# EasyEDA Pro project Dual_ESC_6-24V_3.6A_V4_Easy_EDA.epro

# Schematic Schematic1_3
Board Name: Dual ESC 6-24V 3.6A V4; Create Date: 2026-04-15; Page Name: P1; Project Name: Robin Dual ESC 6-24V 3.7A; Schematic Name: Schematic1_3; Update Date: 2026-05-05; Company: EasyEDA.com; Page Size: A4; Version: V1.0
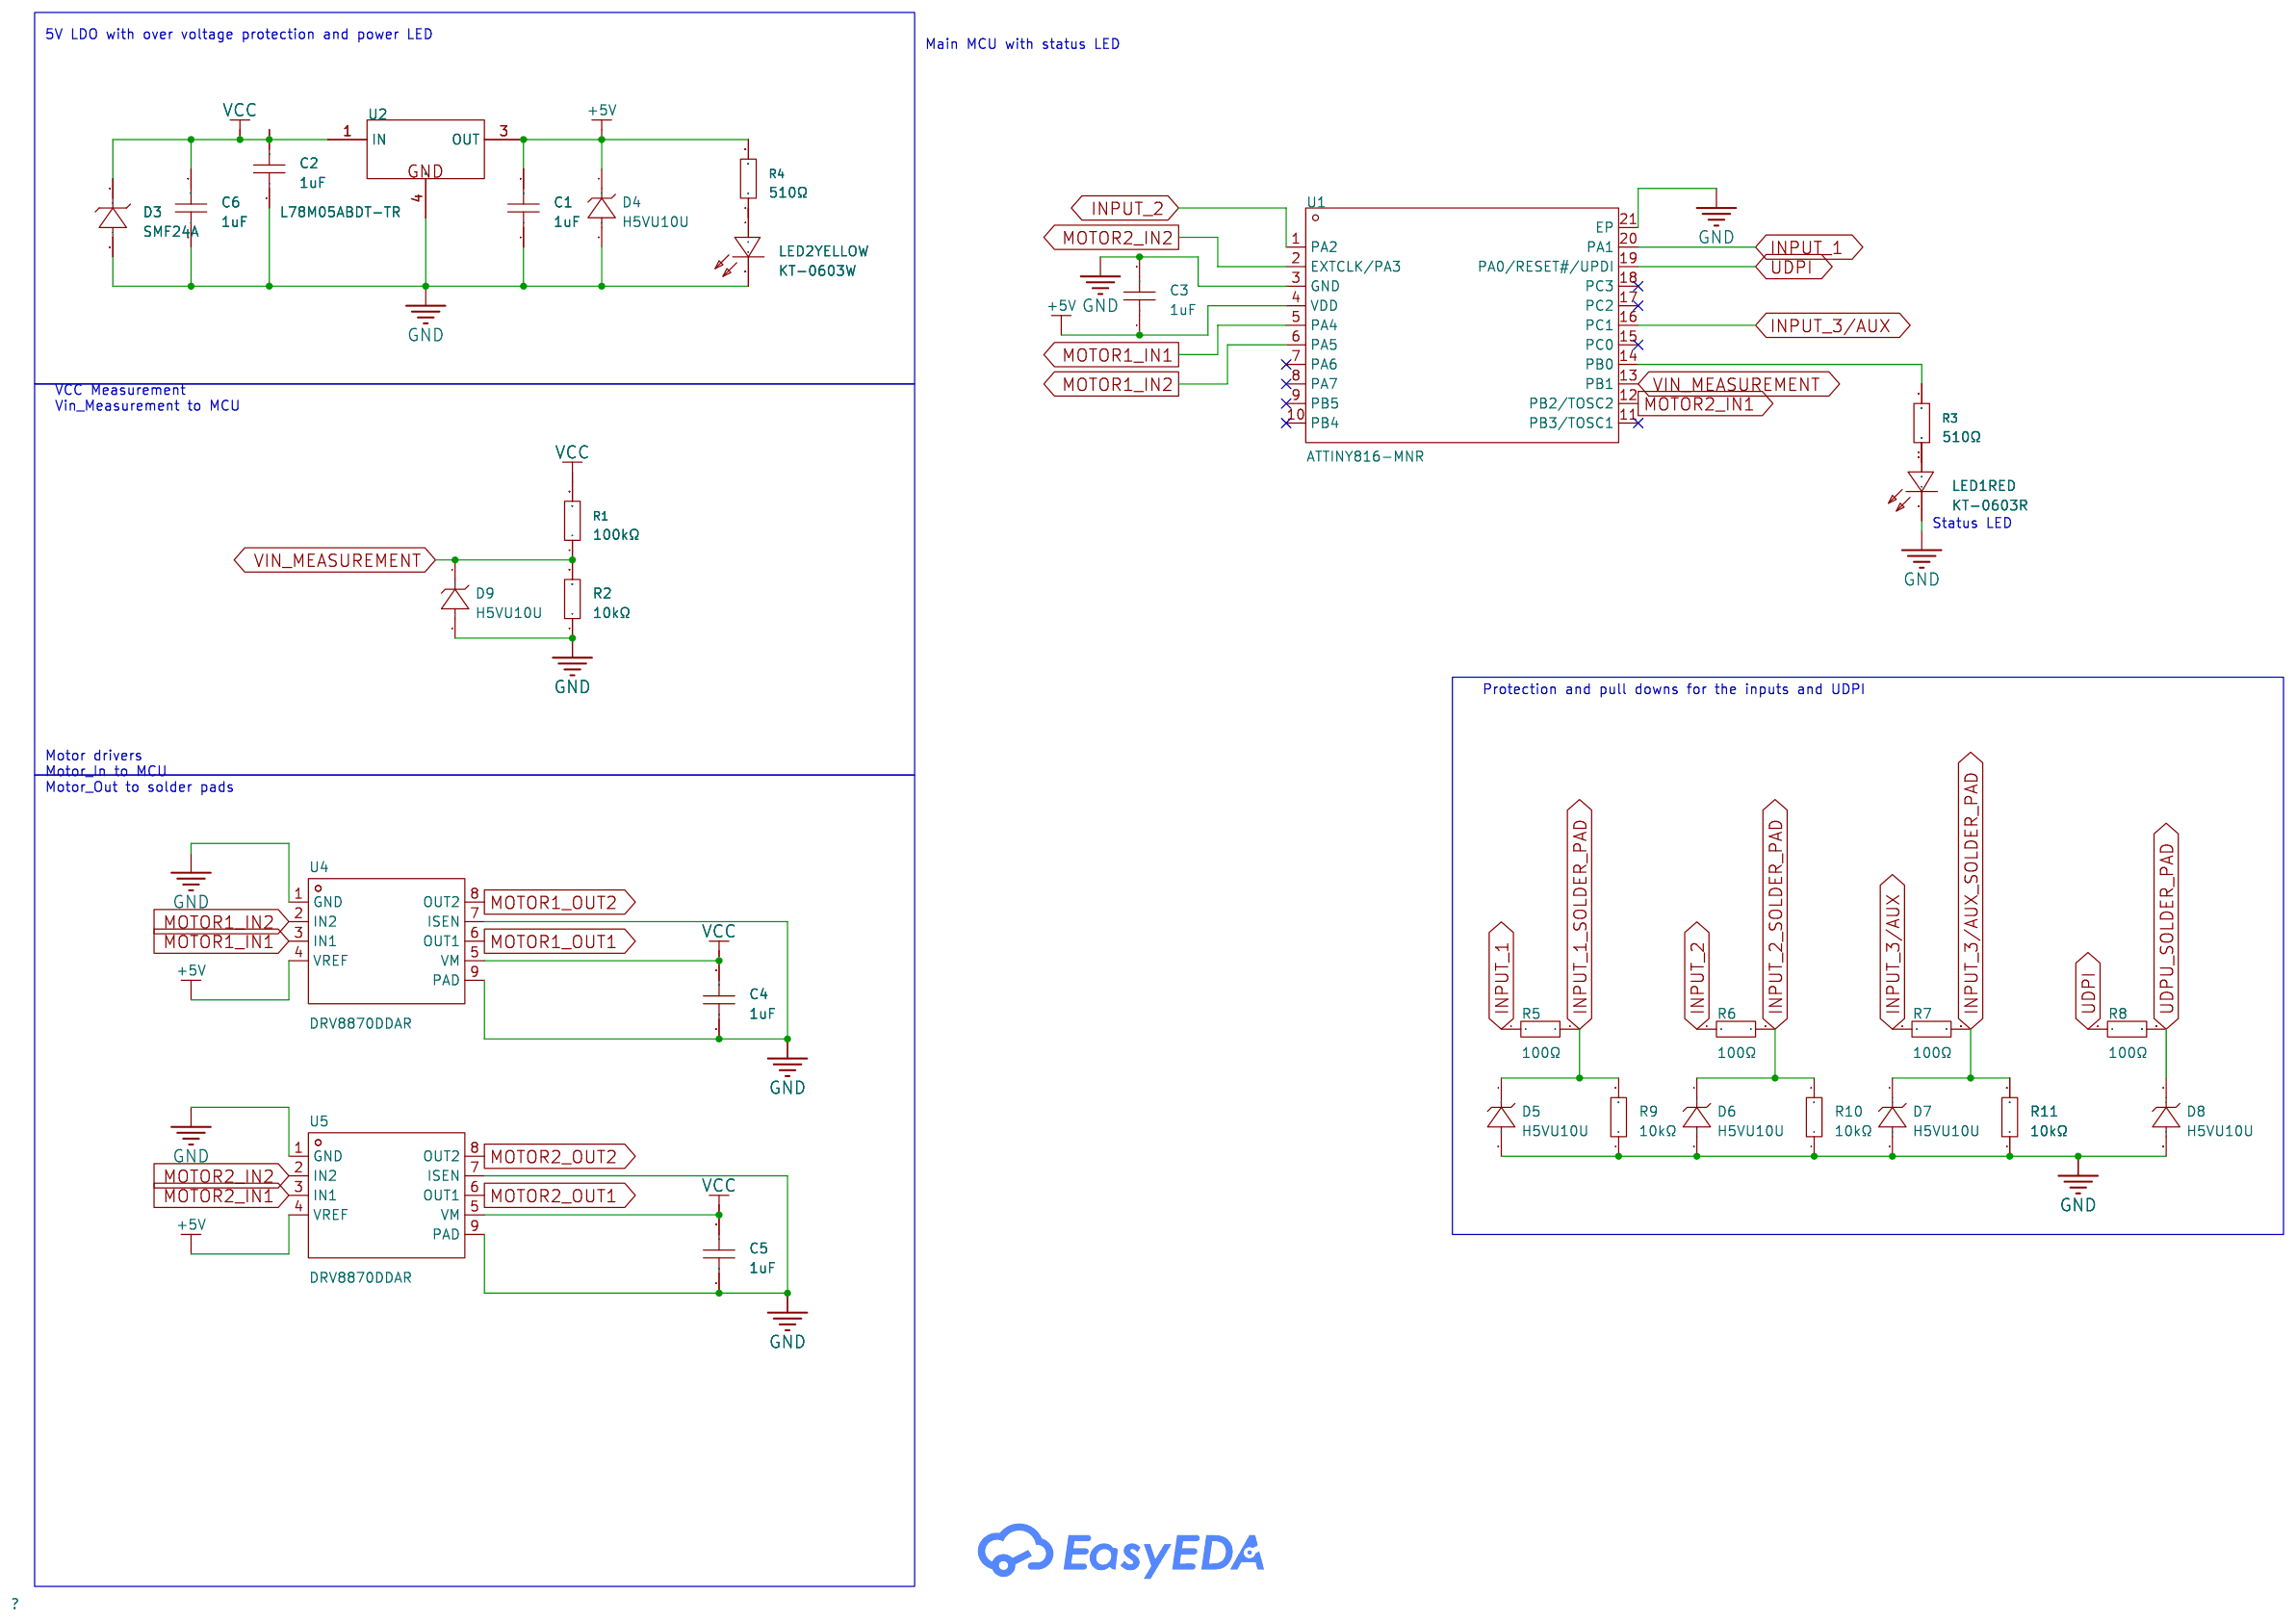
[diagram p0: schematic sheet]

## Parts
C1  1uF  [C0402]
C2  1uF  [C0603]
C3  1uF  [C0402]
C4  1uF  [C0603]
C5  1uF  [C0603]
C6  1uF  [C0603]
D3  SMF24A  [SOD-123FL_L2.7-W1.8-LS3.8-RD]
D4  H5VU10U  [DFN1006-2L-RD]
D5  H5VU10U  [DFN1006-2L-RD]
D6  H5VU10U  [DFN1006-2L-RD]
D7  H5VU10U  [DFN1006-2L-RD]
D8  H5VU10U  [DFN1006-2L-RD]
D9  H5VU10U  [DFN1006-2L-RD]
LED1RED  KT-0603R  [LED0603-RD]
LED2YELLOW  KT-0603W  [LED0603-R-RD_WHITE]
R1  100kΩ  [R0402]
R2  10kΩ  [R0402]
R3  510Ω  [R0402]
R4  510Ω  [R0402]
R5  100Ω  [R0402]
R6  100Ω  [R0402]
R7  100Ω  [R0402]
R8  100Ω  [R0402]
R9  10kΩ  [R0402]
R10  10kΩ  [R0402]
R11  10kΩ  [R0402]
U1  ATTINY816-MNR  [UQFN-20_L3.0-W3.0-P0.40-BL-EP1.7]
U2  L78M05ABDT-TR  [TO-252-2_L6.5-W6.1-P4.58-LS10.0-TL]
U4  DRV8870DDAR  [HSOP-8_L5.0-W4.0-P1.27-LS6.2-BL-EP]
U5  DRV8870DDAR  [HSOP-8_L5.0-W4.0-P1.27-LS6.2-BL-EP]

## Library data of the parts
C1 C3 = CL05A105KA5NQNC: Capacitance:1uF Tolerance:±10% Tolerance:±10% Voltage Rating:25V Temperature Coefficient:X5R; LCSC Part Name: 1uF ±10% 25V; Supplier Part: C52923; Manufacturer: SAMSUNG(三星); Supplier Footprint: 0402; JLCPCB Part Class: Basic Part; Datasheet: https://item.szlcsc.com/datasheet/CL05A105KA5NQNC/53938.html; Supplier: LCSC; Tolerance: ±10%; Voltage Rating: 25V; Temperature Coefficient: X5R
C2 C4-C6 = CL10A105KB8NNNC: Capacitance:1uF Tolerance:±10% Tolerance:±10% Voltage Rating:50V Temperature Coefficient:X5R; LCSC Part Name: 1uF ±10% 50V; Supplier Part: C15849; Manufacturer: SAMSUNG(三星); Supplier Footprint: 0603; JLCPCB Part Class: Basic Part; Datasheet: https://item.szlcsc.com/datasheet/CL10A105KB8NNNC/16531.html; Supplier: LCSC; Tolerance: ±10%; Voltage Rating: 50V; Temperature Coefficient: X5R
D3 = SMF24A_C19077514: Polarity:Unidirectional Reverse Stand-Off Voltage (Vrwm):24V Clamping Voltage:38.9V Peak Pulse Current (Ipp):5.1A@10/1000us Peak Pulse Power Dissipation (Ppp):200W@10/1000us Voltage - Breakdown:29.5V Reverse Leakage Current (Ir):1uA Number of Channels:1.0; LCSC Part Name: 单向TVS 24V截止 峰值浪涌电流：5.1A@10/1000us; Supplier Part: C19077514; Manufacturer: R+O(宏嘉诚); Supplier Footprint: SOD-123FL; JLCPCB Part Class: Extended Part; Datasheet: https://item.szlcsc.com/datasheet/SMF24A/20275599.html; Supplier: LCSC; Polarity: Unidirectional; Reverse Stand-Off Voltage (Vrwm): 24V; Clamping Voltage: 38.9V; Peak Pulse Current (Ipp): 5.1A@10/1000us; Peak Pulse Power Dissipation (Ppp): 200W@10/1000us; Voltage - Breakdown: 29.5V; Reverse Leakage Current (Ir): 1uA; Number of Channels: 1.0; Operating Temperature: -55℃~+150℃; level of protection: IEC 61000-4-2; Type: TVS
D4-D9 = H5VU10U: Polarity:Unidirectional Reverse Stand-Off Voltage (Vrwm):5V Clamping Voltage:16V Peak Pulse Current (Ipp):5A@8/20us Peak Pulse Power Dissipation (Ppp):55W@8/20us Voltage - Breakdown:6V Reverse Leakage Current (Ir):200nA Operating Temperature:-55℃~+155℃ Op; LCSC Part Name: 丝印:5U 单向ESD 5V截止 峰值浪涌电流：5A@8/20us; Supplier Part: C22395519; Manufacturer: R+O(宏嘉诚); Supplier Footprint: DFN1006-2L; JLCPCB Part Class: Extended Part; Datasheet: https://item.szlcsc.com/datasheet/H5VU10U/23994516.html; Supplier: LCSC; Polarity: Unidirectional; Reverse Stand-Off Voltage (Vrwm): 5V; Clamping Voltage: 16V; Peak Pulse Current (Ipp): 5A@8/20us; Peak Pulse Power Dissipation (Ppp): 55W@8/20us; Voltage - Breakdown: 6V; Reverse Leakage Current (Ir): 200nA; Operating Temperature: -55℃~+155℃; level of protection: IEC 61000-4-5；IEC 61000-4-2; Type: ESD; Junction Capacitance: 0.8pF
LED1RED = KT-0603R: Emitted Color:Red Power Dissipation:- Forward Current:- Dominant Wavelength:- Dominant Wavelength:- Peak Wavelength:- Diode Configuration:- Lens Color:- Color Temperature:- Color Temperature:- Viewing Angle:- Mounting Sytle:- Operating Temperature:-40℃~+8; LCSC Part Name: 0603 红灯 高亮; Supplier Part: C2286; Manufacturer: KENTO; Supplier Footprint: 0603; JLCPCB Part Class: Basic Part; Datasheet: https://atta.szlcsc.com/upload/public/pdf/source/20160616/1466072038404.pdf; Supplier: LCSC; Emitted Color: Red; Operating Temperature: -40℃~+85℃
LED2YELLOW = KT-0603W: Illumination Color:White Voltage - Forward(Vf):2.6V~3.1V Voltage - Forward(Vf):2.6V~3.1V Power(Watts):100mW Forward Current:5mA Diode Configuration:Discrete Diode Lens Color:Yellow Lens Luminous Intensity:360mcd Luminous Intensity:360mcd Viewing Angle:120; LCSC Part Name: 0603 白灯 高亮; Supplier Part: C2290; Manufacturer: KENTO; Supplier Footprint: 0603; JLCPCB Part Class: Basic Part; Datasheet: https://item.szlcsc.com/datasheet/KT-0603W/2663.html; Supplier: LCSC; Illumination Color: White; Voltage - Forward(Vf): 2.6V~3.1V; Power(Watts): 100mW; Forward Current: 5mA; Diode Configuration: Discrete Diode; Lens Color: Yellow Lens; Luminous Intensity: 360mcd; Viewing Angle: 120°; Mounting Style: Top-mount
R1 = 0402WGF1003TCE: Type:Thick Film Resistor Resistance:100kΩ Tolerance:±1% Tolerance:±1% Power(Watts):62.5mW Voltage-Supply(Max):50V Temperature Coefficient:±100ppm/℃ Temperature Coefficient:±100ppm/℃ Operating Temperature:-55℃~+155℃ Operating Temperature:-55℃~+155℃; LCSC Part Name: 100kΩ ±1% 62.5mW 厚膜电阻; Supplier Part: C25741; Manufacturer: UNI-ROYAL(厚声); Supplier Footprint: 0402; JLCPCB Part Class: Basic Part; Datasheet: https://item.szlcsc.com/datasheet/0402WGF1003TCE/26484.html; Supplier: LCSC; Type: Thick Film Resistor; Tolerance: ±1%; Power(Watts): 62.5mW; Voltage-Supply(Max): 50V; Temperature Coefficient: ±100ppm/℃; Operating Temperature: -55℃~+155℃
R2 R9-R11 = 0402WGF1002TCE: Type:Thick Film Resistor Resistance:10kΩ Tolerance:±1% Tolerance:±1% Power(Watts):62.5mW Voltage-Supply(Max):50V Temperature Coefficient:±100ppm/℃ Temperature Coefficient:±100ppm/℃ Operating Temperature:-55℃~+155℃ Operating Temperature:-55℃~+155℃; LCSC Part Name: 10kΩ ±1% 62.5mW 厚膜电阻; Supplier Part: C25744; Manufacturer: UNI-ROYAL(厚声); Supplier Footprint: 0402; JLCPCB Part Class: Basic Part; Datasheet: https://item.szlcsc.com/datasheet/0402WGF1002TCE/26487.html; Supplier: LCSC; Type: Thick Film Resistor; Tolerance: ±1%; Power(Watts): 62.5mW; Voltage-Supply(Max): 50V; Temperature Coefficient: ±100ppm/℃; Operating Temperature: -55℃~+155℃
R3 R4 = 0402WGF5100TCE: Type:Thick Film Resistor Resistance:510Ω Tolerance:±1% Tolerance:±1% Power(Watts):62.5mW Voltage-Supply(Max):50V Temperature Coefficient:±100ppm/℃ Temperature Coefficient:±100ppm/℃ Operating Temperature:-55℃~+155℃ Operating Temperature:-55℃~+155℃; LCSC Part Name: 510Ω ±1% 62.5mW 厚膜电阻; Supplier Part: C25123; Manufacturer: UNI-ROYAL(厚声); Supplier Footprint: 0402; JLCPCB Part Class: Basic Part; Datasheet: https://item.szlcsc.com/datasheet/0402WGF5100TCE/25866.html; Supplier: LCSC; Type: Thick Film Resistor; Tolerance: ±1%; Power(Watts): 62.5mW; Voltage-Supply(Max): 50V; Temperature Coefficient: ±100ppm/℃; Operating Temperature: -55℃~+155℃
R5-R8 = 0402WGF1000TCE: Type:Thick Film Resistors Resistance: Tolerance:±1% Tolerance:±1% Power(Watts): Overload Voltage (Max): Temperature Coefficient:±200ppm/℃ Temperature Coefficient:±200ppm/℃ Operating Temperature Range:-55℃~+155℃ Operating Temperature Range:-55℃~+155℃; LCSC Part Name: 100Ω ±1% 62.5mW 厚膜电阻; Supplier Part: C25076; Manufacturer: UNI-ROYAL(厚声); Supplier Footprint: 0402; JLCPCB Part Class: Basic Part; Datasheet: https://atta.szlcsc.com/upload/public/pdf/source/20200306/C422600_1E6D84923E4A46A82E41ADD87F860B5C.pdf; Supplier: LCSC; Type: Thick Film Resistors; Tolerance: ±1%; Temperature Coefficient: ±200ppm/℃; Operating Temperature Range: -55℃~+155℃
U1 = ATTINY816-MNR: CPU Core:AVR CPU Maximum Speed:20MHz Program Storage Size:8KB Program Memory Type:FLASH Number of I/O:18 ADC (Bit):10bit DAC (Bit):8bit Voltage - Supply:1.8V~5.5V Voltage - Supply:1.8V~5.5V Applications:-; LCSC Part Name: 20 MHz AVR CPU; Supplier Part: C2052778; Manufacturer: MICROCHIP(美国微芯); Supplier Footprint: UQFN-20-EP(3x3); JLCPCB Part Class: Extended Part; Datasheet: https://item.szlcsc.com/datasheet/ATTINY816-MNR/2144347.html; Supplier: LCSC; CPU Core: AVR; CPU Maximum Speed: 20MHz; Program Storage Size: 8KB; Program Memory Type: FLASH; Number of I/O: 18; ADC (Bit): 10bit; DAC (Bit): 8bit; Voltage - Supply: 1.8V~5.5V
U2 = L78M05ABDT-TR: Output Type:Fixed Maximum Input Voltage:35V Output Voltage:5V Output Voltage:5V Output Current:500mA Power Supply Rejection Ratio (PSRR):62dB@(120Hz) Dropout Voltage:- standby current:6mA Feature:Short-Circuit  Protection；Thermal Protection(TSD)；Overcurre; LCSC Part Name: 精密500 mA稳压器; Supplier Part: C58069; Manufacturer: ST(意法半导体); Supplier Footprint: TO-252-2(DPAK); JLCPCB Part Class: Basic Part; Datasheet: https://atta.szlcsc.com/upload/public/pdf/source/20230728/311D30A65517FCBD6FE5D1CCA2CA8430.pdf; Supplier: LCSC; Output Type: Fixed; Maximum Input Voltage: 35V; Output Voltage: 5V; Output Current: 500mA; Power Supply Rejection Ratio (PSRR): 62dB@(120Hz); standby current: 6mA; Feature: Short-Circuit  Protection；Thermal Protection(TSD)；Overcurrent Protection(OCP); Operating Temperature: -40℃~+125℃; Output Polarity: Positive electrode; Number of Outputs: 1
U4 U5 = DRV8870DDAR: Technology:Yes Number of H-bridges:1 Output Current:- Output Current:- Peak Current:3.6A Voltage - Supply:- Voltage - Supply:- Interface:- RDS(on):565mΩ Quiescent Current(Iq):10uA Operating Temperature:-40℃~+125℃ Operating Temperature:-40℃~+125℃; LCSC Part Name: 刷式直流电机驱动器（PWM控制）; Supplier Part: C86590; Manufacturer: TI(德州仪器); Supplier Footprint: HSOP-8-EP; JLCPCB Part Class: Extended Part; Datasheet: https://www.ti.com/cn/lit/gpn/drv8870; Supplier: LCSC; Technology: Yes; Number of H-bridges: 1; Peak Current: 3.6A; RDS(on): 565mΩ; Quiescent Current(Iq): 10uA; Operating Temperature: -40℃~+125℃

## Nets
+5V: C1.2 C3.1 D4.1(K) R4.2 U1.4(VDD) U2.3(OUT) U4.4(VREF) U5.4(VREF)
GND: C1.1 C2.1 C3.2 C4.1 C5.1 C6.1 D3.2(A) D4.2(A) D5.2(A) D6.2(A) D7.2(A) D8.2(A) D9.2(A) LED1RED.1(K) LED2YELLOW.2(K) R2.1 R9.1 R10.1 R11.1 U1.3(GND) U1.21(EP) U2.4(GND) U4.1(GND) U4.7(ISEN) U4.9(PAD) U5.1(GND) U5.7(ISEN) U5.9(PAD)
VCC: C2.2 C4.2 C5.2 C6.2 D3.1(K) R1.2 U2.1(IN) U4.5(VM) U5.5(VM)
VIN_MEASUREMENT: D9.1(K) R1.1 R2.2 U1.13(PB1)
INPUT_1: R5.1 U1.20(PA1)
INPUT_1_SOLDER_PAD: D5.1(K) R5.2 R9.2
INPUT_2: R6.1 U1.1(PA2)
INPUT_2_SOLDER_PAD: D6.1(K) R6.2 R10.2
INPUT_3/AUX: R7.1 U1.16(PC1)
INPUT_3/AUX_SOLDER_PAD: D7.1(K) R7.2 R11.2
MOTOR1_IN1: U1.5(PA4) U4.3(IN1)
MOTOR1_IN2: U1.6(PA5) U4.2(IN2)
MOTOR1_OUT1: U4.6(OUT1)
MOTOR1_OUT2: U4.8(OUT2)
MOTOR2_IN1: U1.12(PB2/TOSC2) U5.3(IN1)
MOTOR2_IN2: U1.2(EXTCLK/PA3) U5.2(IN2)
MOTOR2_OUT1: U5.6(OUT1)
MOTOR2_OUT2: U5.8(OUT2)
UDPI: R8.1 U1.19(PA0/RESET#/UPDI)
UDPU_SOLDER_PAD: D8.1(K) R8.2
$1N1764: LED1RED.2(A) R3.1
$1N1846: LED2YELLOW.1(A) R4.1
$1N2743: R3.2 U1.14(PB0)

Not connected (* = marked no-connect by the designer): U1 7(PA6)* 8(PA7)* 9(PB5)* 10(PB4)* 11(PB3/TOSC1)* 15(PC0)* 17(PC2)* 18(PC3)*

## Notes on the sheet
- 5V LDO with over voltage protection and power LED
- Main MCU with status LED
- VCC Measurement
  Vin_Measurement to MCU
- Status LED
- Protection and pull downs for the inputs and UDPI
- Motor drivers
  Motor_In to MCU
  Motor_Out to solder pads

# Board PCB4_2
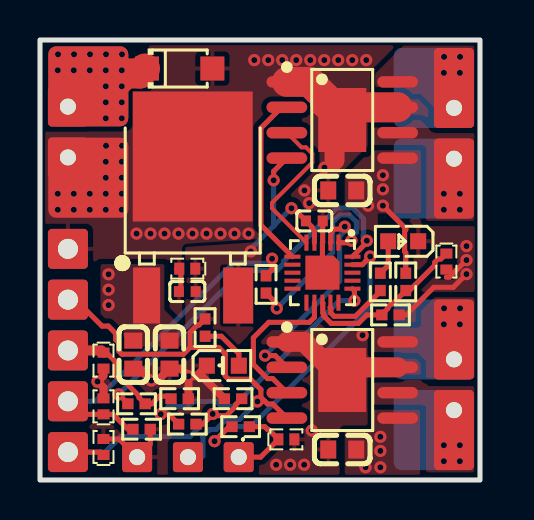
[diagram p1: board, top side]
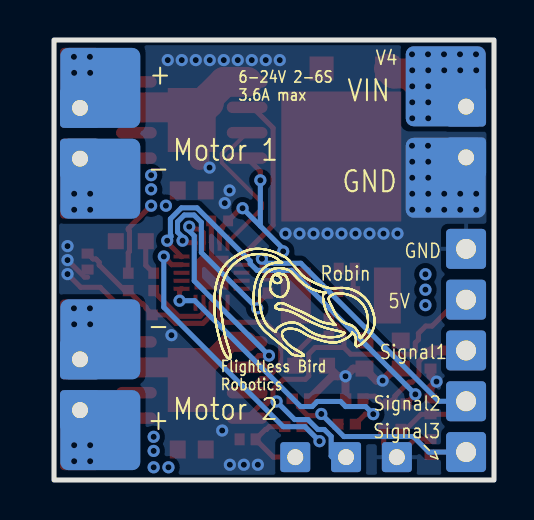
[diagram p2: board, bottom side, seen from below]

Outline 22 x 22 mm; copper layers: Top Layer, Inner1, Inner2, Bottom Layer. Coordinates in mm from the lower left corner of the outline.
Outline path: rectangle 0,22 22,0
Stack: Top Layer 0.035mm Outer layer thickness 1oz / Dielectric1 0.2104mm 7628 RC49% 8.6mil / Inner1 0.0152mm Inner layer thickness / Dielectric2 1.065mm 1.1mm H/HOZ Copper / Inner2 0.0152mm Inner layer thickness / Dielectric3 0.2104mm 7628 RC49% 8.6mil / Bottom Layer 0.035mm Outer layer thickness 1oz

## Design rules (mm)
template: Custom Config
spacing copperThickness1oz (default): track to track 0.102, other pairs 0.152 to 0.3
spacing copperThickness2oz: track to track 0.203, other pairs 0.152 to 0.3
track width copperThickness1oz (default): min 0.127, default 0.254, max 2.54
track width copperThickness2oz: min 0.203, default 0.254, max 2.54
differential pair differentialPair (default): width min 0.127, default 0.254, max 2.54; gap min 0.152, default 0.152
via viaSize (default): diameter min 0.5, default 0.61, max 10; hole min 0.3, default 0.305, max 6.3
net VCC uses Power
pour e118 uses Power
pour e122 uses Power
pour e143 uses Power
pour e145 uses Power

## Placement (name value [footprint] x y rotation side)
C1  1uF  [C0402]  7.37 9.42 0 top
C2  1uF  [C0603]  6.48 6.27 90 top
C3  1uF  [C0402]  13.72 12.95 0 top
C4  1uF  [C0603]  15.11 14.48 0 top
C5  1uF  [C0603]  15.11 1.52 0 top
C6  1uF  [C0603]  4.66 6.27 90 top
D3  SMF24A  [SOD-123FL_L2.7-W1.8-LS3.8-RD]  6.99 20.57 0 top
D4  H5VU10U  [DFN1006-2L-RD]  7.37 10.57 180 top
D5  H5VU10U  [DFN1006-2L-RD]  3.18 5.97 270 top
D6  H5VU10U  [DFN1006-2L-RD]  3.18 3.68 90 top
D7  H5VU10U  [DFN1006-2L-RD]  3.18 1.65 90 top
D8  H5VU10U  [DFN1006-2L-RD]  12.32 2.03 0 top
D9  H5VU10U  [DFN1006-2L-RD]  20.32 10.92 270 top
LED1RED  KT-0603R  [LED0603-RD]  18.16 11.94 180 top
LED2YELLOW  KT-0603W  [LED0603-R-RD_WHITE]  9.14 5.72 0 top
NOREF  -  [Pad_e44]  19.69 7.03 0 top
NOREF#2  -  [Pad_e40]  2.41 15.11 0 top
NOREF#3  -  [Pad_e42]  19.69 15.07 0 top
NOREF#4  -  [Pad_e35]  9.94 1.14 0 top
NOREF#5  -  [Pad_e47]  2.41 15.11 0 top
NOREF#6  -  [Pad_e43]  19.69 2.49 0 top
NOREF#7  -  [Pad_e25]  1.4 3.94 0 top
NOREF#8  -  [Pad_e2810]  20.7 6.03 0 top
NOREF#9  -  [Pad_e27]  1.4 9.02 0 top
NOREF#10  -  [Pad_e38]  2.41 19.69 0 top
NOREF#11  -  [Pad_e41]  19.69 19.61 0 top
NOREF#12  -  [Pad_e32]  4.86 1.14 0 top
NOREF#13  -  [Pad_e52]  20.7 2.49 0 top
NOREF#14  -  [Pad_e28]  1.4 11.56 0 top
NOREF#15  -  [Pad_e23]  1.4 1.4 0 top
NOREF#16  -  [Pad_e34]  7.4 1.14 0 top
NOREF#17  -  [Pad_e48]  20.7 19.61 0 top
NOREF#18  -  [Pad_e53]  20.7 7.03 0 top
NOREF#19  -  [Pad_e26]  1.4 6.48 0 top
NOREF#20  -  [Pad_e51]  20.7 15.07 0 top
NOREF#21  -  [Pad_e46]  2.41 19.69 0 top
NOREF#22  -  [Pad_e2807]  1.4 16.13 0 top
NOREF#23  -  [Pad_e2808]  20.7 18.61 0 top
NOREF#24  -  [Pad_e2809]  20.7 16.07 0 top
NOREF#25  -  [Pad_e2806]  1.4 18.67 0 top
NOREF#26  -  [Pad_e2811]  20.7 3.49 0 top
R1  100kΩ  [R0402]  18.29 9.91 90 top
R2  10kΩ  [R0402]  17.53 8.25 180 top
R3  510Ω  [R0402]  17.02 9.91 270 top
R4  510Ω  [R0402]  8.25 7.62 90 top
R5  100Ω  [R0402]  4.83 3.81 0 top
R6  100Ω  [R0402]  11.3 9.78 90 top
R7  100Ω  [R0402]  7.37 2.79 0 top
R8  100Ω  [R0402]  10.03 2.67 0 top
R9  10kΩ  [R0402]  6.98 4.06 180 top
R10  10kΩ  [R0402]  5.08 2.54 180 top
R11  10kΩ  [R0402]  9.65 4.06 0 top
U1  ATTINY816-MNR  [UQFN-20_L3.0-W3.0-P0.40-BL-EP1.7]  14.12 10.36 180 top
U2  L78M05ABDT-TR  [TO-252-2_L6.5-W6.1-P4.58-LS10.0-TL]  7.62 12.7 90 top
U4  DRV8870DDAR  [HSOP-8_L5.0-W4.0-P1.27-LS6.2-BL-EP]  15.11 18 270 top
U5  DRV8870DDAR  [HSOP-8_L5.0-W4.0-P1.27-LS6.2-BL-EP]  15.11 5 270 top

## Footprints (pads in the part's own frame, mm; a bottom-side part is the same pattern mirrored in y, then rotated)
C0402
  rect 0.5x0.54 smd: 1(-0.42,0) 2(0.42,0)
C0603
  rect 0.8x0.9 smd: 1(-0.7,0) 2(0.7,0)
DFN1006-2L-RD
  rect 0.5x0.6 smd: 1(-0.4,0) 2(0.4,0)
HSOP-8_L5.0-W4.0-P1.27-LS6.2-BL-EP
  oval 0.574x2.038 smd: 1(-1.905,-2.769) 2(-0.635,-2.769) 3(0.635,-2.769) 4(1.905,-2.769) 5(1.905,2.769) 6(0.635,2.769) 7(-0.635,2.769) 8(-1.905,2.769)
  rect 3.2x2.4 smd: 9(0,0)
LED0603-R-RD_WHITE
  rect 0.8x0.8 smd: 1(0.8,0) 2(-0.8,0)
LED0603-RD
  rect 0.8x0.8 smd: 1(-0.749,0) 2(0.749,0)
Pad_e23
  rrect 2x2 hole 1: 1(0,0)
Pad_e25
  rrect 2x2 hole 1: 1(0,0)
Pad_e26
  rrect 2x2 hole 1: 1(0,0)
Pad_e27
  rrect 2x2 hole 1: 1(0,0)
Pad_e28
  rrect 2x2 hole 1: 1(0,0)
Pad_e32
  rrect 1.5x1.5 hole 0.8: 1(0,0)
Pad_e34
  rrect 1.5x1.5 hole 0.8: 1(0,0)
Pad_e35
  rrect 1.5x1.5 hole 0.8: 2(0,0)
Pad_e38
  rrect 4x4 smd: 1(0,0)
Pad_e40
  rrect 4x4 smd: 1(0,0)
Pad_e41
  rrect 4x4 smd far side: 1(0,0)
Pad_e42
  rrect 4x4 smd far side: 1(0,0)
Pad_e43
  rrect 4x4 smd far side: 2(0,0)
Pad_e44
  rrect 4x4 smd far side: 3(0,0)
Pad_e46
  rrect 4x4 smd far side: 1(0,0)
Pad_e47
  rrect 4x4 smd far side: 1(0,0)
Pad_e48
  rrect 2x4 smd: 1(0,0)
Pad_e51
  rrect 2x4 smd: 1(0,0)
Pad_e52
  rrect 2x4 smd: 1(0,0)
Pad_e53
  rrect 2x4 smd: 1(0,0)
Pad_e2806
  rrect 2x2 hole 0.8: 1(0,0)
Pad_e2807
  rrect 2x2 hole 0.8: 2(0,0)
Pad_e2808
  rrect 2x2 hole 0.8: 3(0,0)
Pad_e2809
  rrect 2x2 hole 0.8: 4(0,0)
Pad_e2810
  rrect 2x2 hole 0.8: 5(0,0)
Pad_e2811
  rrect 2x2 hole 0.8: 6(0,0)
R0402
  rect 0.566x0.54 smd: 1(-0.433,0) 2(0.433,0)
SOD-123FL_L2.7-W1.8-LS3.8-RD
  rect 1.2x1.2 smd: 1(-1.635,0) 2(1.635,0)
TO-252-2_L6.5-W6.1-P4.58-LS10.0-TL
  rect 2.8x1.35 smd: 1(-3.475,2.29)
  rect 2.8x1.5 smd: 3(-3.475,-2.29)
  rect 6.5x6 smd: 4(3.475,-0.017)
UQFN-20_L3.0-W3.0-P0.40-BL-EP1.7
  rect 0.2x0.8 smd: 1(-0.8,-1.5) 2(-0.4,-1.5) 3(0,-1.5) 4(0.4,-1.5) 5(0.8,-1.5) 11(0.8,1.5) 12(0.4,1.5) 13(0,1.5) 14(-0.4,1.5) 15(-0.8,1.5)
  rect 0.8x0.2 smd: 6(1.5,-0.8) 7(1.5,-0.4) 8(1.5,0) 9(1.5,0.4) 10(1.5,0.8) 16(-1.5,0.799) 17(-1.5,0.4) 18(-1.5,0) 19(-1.5,-0.4) 20(-1.5,-0.802)
  custom 1.7x1.7 smd: 21(0,-0.001)

## Nets
+5V: C1.2 C3.1 D4.1 NOREF#9.1 NOREF#16.1 R4.2 U1.4 U2.3 U4.4 U5.4
GND: C1.1 C2.1 C3.2 C4.1 C5.1 C6.1 D3.2 D4.2 D5.2 D6.2 D7.2 D8.2 D9.2 LED1RED.1 LED2YELLOW.2 NOREF#2.1 NOREF#5.1 NOREF#12.1 NOREF#14.1 NOREF#22.2 R2.1 R9.1 R10.1 R11.1 U1.3 U1.21 U2.4 U4.1 U4.7 U4.9 U5.1 U5.7 U5.9
VCC: C2.2 C4.2 C5.2 C6.2 D3.1 NOREF#10.1 NOREF#21.1 NOREF#25.1 R1.2 U2.1 U4.5 U5.5
VIN_MEASUREMENT: D9.1 R1.1 R2.2 U1.13
INPUT_1: R5.1 U1.20
INPUT_1_SOLDER_PAD: D5.1 NOREF#19.1 R5.2 R9.2
INPUT_2: R6.1 U1.1
INPUT_2_SOLDER_PAD: D6.1 NOREF#7.1 R6.2 R10.2
INPUT_3/AUX: R7.1 U1.16
INPUT_3/AUX_SOLDER_PAD: D7.1 NOREF#15.1 R7.2 R11.2
MOTOR1_IN1: U1.5 U4.3
MOTOR1_IN2: U1.6 U4.2
MOTOR1_OUT1: NOREF#3.1 NOREF#20.1 NOREF#24.4 U4.6
MOTOR1_OUT2: NOREF#11.1 NOREF#17.1 NOREF#23.3 U4.8
MOTOR2_IN1: U1.12 U5.3
MOTOR2_IN2: U1.2 U5.2
MOTOR2_OUT1: NOREF#6.2 NOREF#13.1 NOREF#26.6 U5.6
MOTOR2_OUT2: NOREF.3 NOREF#8.5 NOREF#18.1 U5.8
UDPI: R8.1 U1.19
UDPU_SOLDER_PAD: D8.1 NOREF#4.2 R8.2
$1N1764: LED1RED.2 R3.1
$1N1846: LED2YELLOW.1 R4.1
$1N2743: R3.2 U1.14

Pads without a net: U1 7 8 9 10 11 15 17 18

## Via types
v1: diameter 0.61, hole 0.305, Top Layer to Bottom Layer, 107 vias

## Routing (per net, layer and track width the routed paths; a pad name or vN(x,y) marks a point on that pad's centre or on a via; arc(x,y) is an arc through that point)
+5V: length 31.3
  Top Layer w0.254: 11.25,3.93 v1(10.87,3.93) ; 11.25,3.93 11.05,4.13 11.05,4.52 10.53,5.04 9.43,5.04 9.26,5.2 9.26,6.3 8.94,6.63 7.5,6.63 ; 11.25,3.93 11.38,3.8 11.64,3.8 U5.4 ; U4.4 11.68,15.44 v1(11.68,14.99) ; U1.4 13.72,12.45 13.61,12.57 13.61,12.64 C3.1 12.66,13.59 v1(12.57,13.59) ; 7.5,6.63 7.17,6.29 4.1,6.29 3.93,6.45 3.93,6.86 3.78,7.01 3.78,7.33 3.42,7.7 3.1,7.7 1.78,9.02 NOREF#9.1 ; 7.5,6.63 7.5,7.38 7.87,7.75 7.95,7.75 8.25,8.05
  Bottom Layer w0.254: 11.68,12.7 v1(11.68,14.99) ; 11.68,12.7 10.54,11.56 v1(10.54,11.43) ; 11.68,12.7 v1(12.57,13.59) ; NOREF#16.1 8.09,1.14 8.14,1.2 8.14,2.18 8.49,2.53 8.81,2.53 9.31,3.02 9.97,3.02 v1(10.87,3.93)
GND: length 37.2
  Top Layer w0.254: U1.21 U1.3 14.14,11.88 C3.2 ; v1(21.32,10.3) 20.66,9.63 19.69,9.63 18.31,8.25 R2.1 ; D7.2 3.95,2.05 NOREF#12.1 5.51,1.8 R10.1 ; v1(21.32,11) 20.47,10.14 20.32,10.14 ; 6.82,10.54 7.04,10.32 7.04,9.4
  Top Layer w0.4: v1(7.43,5.19) 7.82,5.19 ; v1(7.43,5.19) 7.05,5.57 C2.1 5.88,4.97 v1(5.57,4.97) 4.97,5.57 C6.1 ; v1(7.43,5.19) 7.43,4.07 R9.1 ; 7.82,5.19 LED2YELLOW.2 ; 7.82,5.19 8.09,5.19 R11.1 ; D5.2 3.18,5.22 v1(2.88,4.92) 3.18,4.62 D6.2
  Top Layer w1: 14.6,4.49 U5.9 13.21,6.91 U5.1 ; 15.61,5.5 15.75,5.64 U5.7 ; 14.73,16 14.73,17.62 U4.9
  Top Layer w1.5: U4.9 14.26,18.85 14.26,19.13 13.49,19.91 U4.1 ; U4.7 15.75,18.64 15.61,18.5
  vias: v1(0.89,14.31) v1(0.89,13.51) v1(1.69,14.31) v1(1.69,13.51) v1(2.49,14.31) v1(2.49,13.51) v1(3.3,16.71) v1(3.29,15.91) v1(3.29,15.11) v1(3.29,14.31) v1(3.29,13.51) v1(4.1,16.71) v1(4.09,15.91) v1(4.09,15.11) v1(4.09,14.31) v1(4.09,13.51) v1(4.83,12.32) v1(5.53,12.32) v1(6.23,12.32) v1(6.93,12.32) v1(7.63,12.32) v1(8.33,12.32) v1(9.03,12.32) v1(9.73,12.32) v1(10.43,12.32) v1(10.71,21) v1(11.41,21) v1(11.81,0.76) v1(12.11,21) v1(12.51,0.76) v1(12.81,21) v1(13.22,14.48) v1(13.21,0.76) v1(13.51,21) v1(13.46,13.84) v1(13.59,2.47) v1(14.21,21) v1(14.22,15.62) v1(14.91,21) v1(15.61,21) v1(16.13,7.24) v1(16.31,21) v1(21.32,11.69)
VCC: length 7.1
  Top Layer w0.254: R1.2 18.29,11.37 18.23,11.42 18.23,12.45 18.29,12.51 18.29,12.57 v1(17.15,13.72)
  Top Layer w1.5: NOREF#10.1 v1(3.29,19.69) 3.62,19.69 4.26,20.33 5,20.33 5.25,20.57
  vias: v1(0.9,21.28) v1(0.89,20.48) v1(1.7,21.28) v1(1.69,20.48) v1(2.5,21.28) v1(2.49,20.48) v1(3.3,21.28) v1(3.29,20.48) v1(3.29,18.89) v1(3.29,18.08) v1(3.43,10.29) v1(3.43,9.52) v1(3.43,8.74) v1(4.1,21.28) v1(4.09,20.48) v1(4.09,19.69) v1(4.09,18.89) v1(4.09,18.08) v1(16.28,0.64) v1(16.41,13.72) v1(17.02,2.16) v1(17.02,1.45) v1(17.02,0.64) v1(17.15,15.24) v1(17.15,14.53)
VIN_MEASUREMENT: length 8.6
  Top Layer w0.254: D9.1 20.05,11.05 19.9,11.05 19.74,10.89 19.74,10.74 18.47,9.47 R1.1 17.62,8.8 17.56,8.8 17.4,8.64 17.4,8.58 17.09,8.28 17.09,8.25 16.34,8.25 15.92,7.83 14.56,7.83 14.19,8.2 14.19,8.31 14.14,8.35 14.14,8.84 U1.13
INPUT_1: length 19.3
  Top Layer w0.254: v1(3.93,4.28) 4.28,3.94 4.39,3.94 ; v1(16.34,11.97) 16.34,11.89 U1.20
  Bottom Layer w0.254: v1(3.93,4.28) 10.13,10.48 11.85,10.48 12.19,10.82 12.19,10.94 14.85,13.61 15.63,13.61 16.18,13.06 16.18,12.25 16.16,12.23 16.16,12.15 v1(16.34,11.97)
INPUT_1_SOLDER_PAD: length 6.9
  Top Layer w0.254: D5.1 3.32,6.37 3.75,5.93 3.75,5.23 4.1,4.89 4.26,4.89 4.96,4.2 4.96,4.11 R5.2 5.59,3.81 5.97,4.19 6.42,4.19 R9.2
  Top Layer w0.5: NOREF#19.1 3.07,6.48 D5.1
INPUT_2: length 9.7
  Top Layer w0.254: R6.1 11.84,8.81 v1(11.84,8.58) ; v1(15.57,11.97) 15.47,11.86 U1.1
  Bottom Layer w0.254: v1(15.57,11.97) 15.57,12.15 15.82,12.4 15.82,12.91 15.48,13.25 15,13.25 14.63,12.88 14.63,11.37 v1(11.84,8.58)
INPUT_2_SOLDER_PAD: length 17.7
  Top Layer w0.254: v1(11.6,11.06) 11.6,10.51 R6.2 ; NOREF#7.1 2.05,3.28 D6.1 3.65,3.28 4.39,2.54
  Bottom Layer w0.254: v1(11.6,11.06) 11.38,10.84 9.66,10.84 2.76,3.94 NOREF#7.1
INPUT_3/AUX: length 14
  Top Layer w0.254: v1(15.72,8.97) 15.72,9.47 U1.16 ; 6.93,2.79 6.44,3.29 v1(6.04,3.29)
  Bottom Layer w0.254: v1(15.72,8.97) 14.96,8.97 9.67,3.67 9.09,3.67 8.84,3.93 7.67,3.93 7.42,3.67 6.42,3.67 v1(6.04,3.29)
INPUT_3/AUX_SOLDER_PAD: length 12.9
  Top Layer w0.254: 7.67,2.79 8.14,2.79 8.56,3.22 9.32,3.22 9.78,3.68 9.78,3.76 R11.2 ; 3.18,1.25 3.03,1.4 NOREF#15.1
  Bottom Layer w0.254: NOREF#15.1 3.26,1.4 4.04,2.17 7.51,2.17 v1(8.64,3.3)
MOTOR1_IN1: length 7.7
  Top Layer w0.2: U1.5 11.6,13.59 11.6,13.86 13.62,15.87 13.62,16.32 13.3,16.63 13.07,16.63 U4.3
MOTOR1_IN2: length 8.8
  Top Layer w0.254: U1.6 11.05,12.74 11.05,17.6 12.08,18.64 U4.2
MOTOR1_OUT1:
  vias: v1(20.19,14.31) v1(20.19,13.51) v1(20.99,14.31) v1(20.99,13.51)
MOTOR1_OUT2:
  vias: v1(20.2,21.16) v1(20.19,20.36) v1(21,21.16) v1(20.99,20.36)
MOTOR2_IN1: length 7.8
  Top Layer w0.254: U1.12 13.72,8.14 13.47,7.88 11.44,7.88 10.67,7.11 10.67,5.78 11.38,5.07 11.64,5.07 U5.3
MOTOR2_IN2: length 10.8
  Top Layer w0.254: U5.2 11.76,6.22 v1(11.25,6.22) ; U1.2 14.54,11.89 14.54,12.38 14.71,12.54 15.2,12.54 15.24,12.58 v1(15.24,12.67)
  Bottom Layer w0.254: v1(11.25,6.22) 14.99,9.96 14.99,12.21 15.24,12.46 v1(15.24,12.67)
MOTOR2_OUT1:
  vias: v1(20.19,1.74) v1(20.19,0.94) v1(20.99,1.74) v1(20.99,0.94)
MOTOR2_OUT2:
  vias: v1(20.2,8.58) v1(20.19,7.78) v1(21,8.58) v1(20.99,7.78)
UDPI: length 15.3
  Top Layer w0.254: v1(16.51,11.18) 16.3,10.97 16.3,10.95 16.12,10.77 15.62,10.77 ; R8.1 9.45,2.67 v1(8.73,1.94)
  Bottom Layer w0.254: v1(16.51,11.18) 16.51,8.64 10.54,2.67 9.45,2.67 v1(8.73,1.94)
UDPU_SOLDER_PAD: length 4.1
  Top Layer w0.254: NOREF#4.2 11.03,1.14 11.92,2.03 11.42,2.53 11.38,2.53 11.24,2.67 R8.2
$1N1764: length 1.8
  Top Layer w0.254: R3.1 17.41,10.73 LED1RED.2
$1N1846: length 2.6
  Top Layer w0.254: LED2YELLOW.1 9.94,6.31 9.07,7.19 R4.1
$1N2743: length 3.4
  Top Layer w0.254: R3.2 17.02,9.43 15.77,8.19 14.71,8.19 14.54,8.35 14.54,8.59 14.5,8.64

## Copper pours and planes (outline as drawn; the poured copper is in the pictures)
+5V on Top Layer: 11.05,11.8 10.66,7.61 9.91,6.86 9.78,6.86 9.02,7.62 7.37,7.62 7.37,11.56 7.37,11.56
GND on Top Layer: 0,22 22,22 22,0 0,0
GND on Bottom Layer: 0.38,21.75 22.38,21.75 22.38,-0.25 0.38,-0.25
GND on Inner1: 0,22 22,22 22,0 0,0
VCC on Top Layer: 7.19,6.6 7.19,7.55 6.22,8.51 6.22,10.8 3.03,10.8 3.03,7.84 4.19,6.68 4.19,6.6
VCC on Top Layer: 16.64,3.51 19,3.51 19,0.29 18.97,0.25 15.24,0.25 15.24,2.47 16.57,2.47 16.64,2.54
VCC on Top Layer: 16.63,16.49 19.05,16.49 19.05,13.38 19,13.33 16.89,13.33 16.89,12.34 15.95,12.34 15.95,13.33 15.56,13.72 15.24,13.72 15.24,15.19 16.56,16.51 16.64,16.51
VCC on Inner2: 0,22 22,22 22,0 0,0
MOTOR1_OUT1 on Top Layer: 16.64,18 19.04,18 19.39,17.65 19.43,17.65 19.69,17.4 21.72,17.4 21.72,12.95 19.3,12.95 19.3,16.62 16.65,16.62 16.64,16.64
MOTOR1_OUT2 on Top Layer: 21.72,21.72 18.16,21.72 16.76,20.32 16.76,19.3 19.05,19.3 19.69,18.66 19.69,17.65 21.72,17.65
MOTOR2_OUT1 on Top Layer: 16.63,5 19.13,5 19.43,4.7 21.72,4.7 21.72,0.38 19.3,0.38 19.3,3.68 16.63,3.68
MOTOR2_OUT2 on Top Layer: 16.64,7.62 16.64,6.33 18.9,6.33 19.3,5.93 19.3,5.08 21.73,5.08 21.73,9.13 21.72,9.14 19.04,9.14 19.04,7.73 18.92,7.62

## Text on the board
Bottom Silkscreen Layer: 6-24V 2-6S / 3.6A max | Flightless Bird / Robotics | -> | GND | 5V | Signal1 | Signal2 | Signal3 | V4 | Robin | VIN | Motor 1 | Motor 2 | + | -
Top Silkscreen Layer: .
